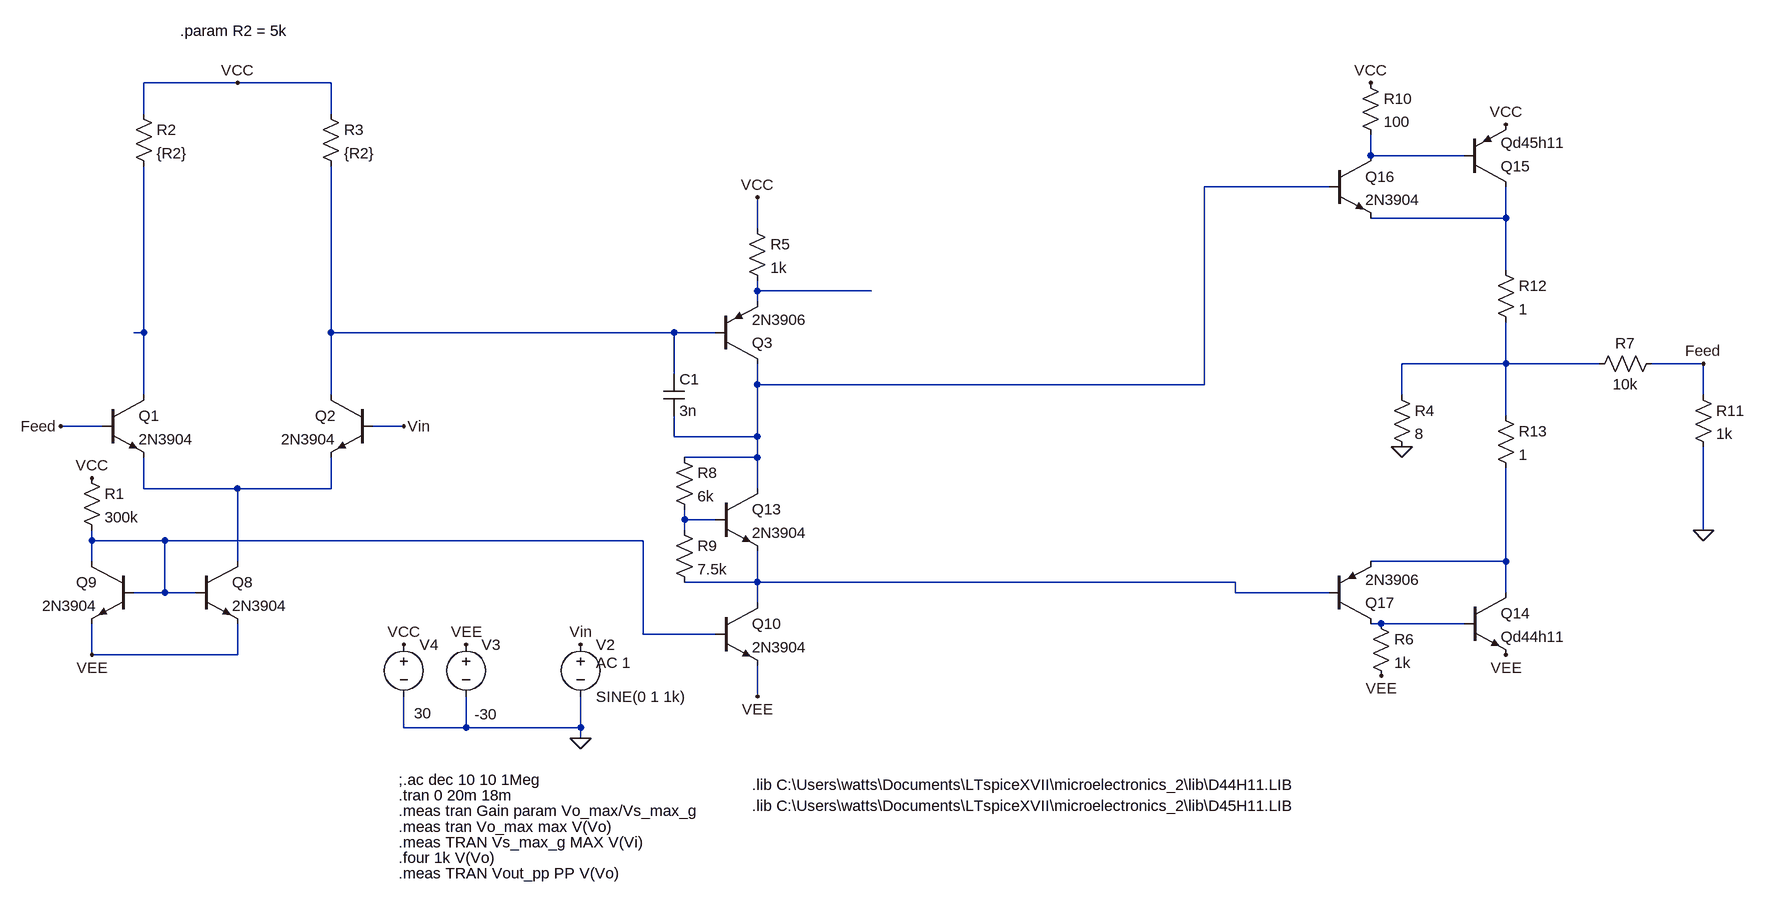
[diagram p0: schematic power_stage.asc]
power_stage.asc, the LTspice schematic file:
Version 4
SHEET 1 2772 704
WIRE 448 -976 304 -976
WIRE 592 -976 448 -976
WIRE 304 -928 304 -976
WIRE 592 -928 592 -976
WIRE 2192 -864 2192 -896
WIRE 2336 -864 2192 -864
WIRE 2128 -816 1936 -816
WIRE 2400 -768 2400 -816
WIRE 2400 -768 2192 -768
WIRE 1248 -752 1248 -800
WIRE 2400 -688 2400 -768
WIRE 1248 -656 1248 -672
WIRE 1424 -656 1248 -656
WIRE 1248 -640 1248 -656
WIRE 304 -592 304 -848
WIRE 304 -592 288 -592
WIRE 592 -592 592 -848
WIRE 1120 -592 592 -592
WIRE 1184 -592 1120 -592
WIRE 2400 -544 2400 -608
WIRE 2400 -544 2240 -544
WIRE 2544 -544 2400 -544
WIRE 2704 -544 2624 -544
WIRE 1120 -528 1120 -592
WIRE 1248 -512 1248 -544
WIRE 1936 -512 1936 -816
WIRE 1936 -512 1248 -512
WIRE 304 -496 304 -592
WIRE 592 -496 592 -592
WIRE 2240 -496 2240 -544
WIRE 2704 -496 2704 -544
WIRE 2400 -464 2400 -544
WIRE 240 -448 176 -448
WIRE 704 -448 656 -448
WIRE 1120 -432 1120 -464
WIRE 1248 -432 1248 -512
WIRE 1248 -432 1120 -432
WIRE 1248 -400 1248 -432
WIRE 1248 -400 1136 -400
WIRE 304 -352 304 -400
WIRE 448 -352 304 -352
WIRE 592 -352 592 -400
WIRE 592 -352 448 -352
WIRE 1248 -352 1248 -400
WIRE 1136 -304 1136 -320
WIRE 1184 -304 1136 -304
WIRE 1136 -288 1136 -304
WIRE 2704 -288 2704 -416
WIRE 224 -272 224 -288
WIRE 336 -272 224 -272
WIRE 1072 -272 336 -272
WIRE 224 -240 224 -272
WIRE 448 -240 448 -352
WIRE 2400 -240 2400 -384
WIRE 2400 -240 2192 -240
WIRE 1248 -208 1248 -256
WIRE 1248 -208 1136 -208
WIRE 1984 -208 1248 -208
WIRE 336 -192 336 -272
WIRE 336 -192 288 -192
WIRE 384 -192 336 -192
WIRE 1984 -192 1984 -208
WIRE 2128 -192 1984 -192
WIRE 2400 -192 2400 -240
WIRE 1248 -176 1248 -208
WIRE 2208 -144 2192 -144
WIRE 2336 -144 2208 -144
WIRE 1072 -128 1072 -272
WIRE 1184 -128 1072 -128
WIRE 224 -96 224 -144
WIRE 448 -96 448 -144
WIRE 448 -96 224 -96
WIRE 1248 -32 1248 -80
WIRE 704 16 704 -32
WIRE 800 16 800 -32
WIRE 800 16 704 16
WIRE 976 16 976 -32
WIRE 976 16 800 16
WIRE 976 32 976 16
FLAG 976 32 0
FLAG 976 -112 Vin
FLAG 800 -112 VEE
FLAG 704 -112 VCC
FLAG 704 -448 Vin
FLAG 448 -976 VCC
FLAG 224 -368 VCC
FLAG 1248 -800 VCC
FLAG 224 -96 VEE
FLAG 1248 -32 VEE
FLAG 176 -448 Feed
FLAG 2192 -976 VCC
FLAG 2400 -912 VCC
FLAG 2400 -96 VEE
FLAG 2208 -64 VEE
FLAG 2704 -288 0
FLAG 2704 -544 Feed
FLAG 2240 -416 0
DATAFLAG 448 -352 ""
DATAFLAG 1328 -512 ""
DATAFLAG 288 -592 ""
DATAFLAG 816 -272 ""
DATAFLAG 1360 -32 "Ic(Q10)"
DATAFLAG 2272 -864 ""
DATAFLAG 2304 -768 ""
DATAFLAG 2304 -240 ""
DATAFLAG 2256 -144 ""
DATAFLAG 1344 -208 ""
DATAFLAG 1136 -304 ""
DATAFLAG 1408 -656 ""
DATAFLAG 784 -592 ""
SYMBOL voltage 976 -128 R0
WINDOW 123 24 44 Left 2
WINDOW 39 0 0 Left 0
SYMATTR Value2 AC 1
SYMATTR InstName V2
SYMATTR Value SINE(0 1 1k)
SYMBOL voltage 800 -128 R0
WINDOW 3 13 123 Left 2
SYMATTR Value -30
SYMATTR InstName V3
SYMBOL voltage 704 -128 R0
WINDOW 3 16 122 Left 2
WINDOW 123 0 0 Left 0
WINDOW 39 0 0 Left 0
SYMATTR Value 30
SYMATTR InstName V4
SYMBOL npn 240 -496 R0
SYMATTR InstName Q1
SYMATTR Value 2N3904
SYMBOL npn 656 -496 M0
SYMATTR InstName Q2
SYMATTR Value 2N3904
SYMBOL res 288 -944 R0
SYMATTR InstName R2
SYMATTR Value {R2}
SYMBOL res 576 -944 R0
SYMATTR InstName R3
SYMATTR Value {R2}
SYMBOL res 1232 -768 R0
SYMATTR InstName R5
SYMATTR Value 1k
SYMBOL pnp 1184 -544 M180
SYMATTR InstName Q3
SYMATTR Value 2N3906
SYMBOL npn 384 -240 R0
SYMATTR InstName Q8
SYMATTR Value 2N3904
SYMBOL npn 288 -240 M0
SYMATTR InstName Q9
SYMATTR Value 2N3904
SYMBOL res 208 -384 R0
SYMATTR InstName R1
SYMATTR Value 300k
SYMBOL npn 1184 -176 R0
SYMATTR InstName Q10
SYMATTR Value 2N3904
SYMBOL npn 1184 -352 R0
SYMATTR InstName Q13
SYMATTR Value 2N3904
SYMBOL res 1120 -416 R0
SYMATTR InstName R8
SYMATTR Value 6k
SYMBOL res 1120 -304 R0
SYMATTR InstName R9
SYMATTR Value 7.5k
SYMBOL pnp 2336 -816 M180
SYMATTR InstName Q15
SYMATTR Value Qd45h11
SYMBOL npn 2336 -192 R0
SYMATTR InstName Q14
SYMATTR Value Qd44h11
SYMBOL npn 2128 -864 R0
SYMATTR InstName Q16
SYMATTR Value 2N3904
SYMBOL res 2176 -992 R0
SYMATTR InstName R10
SYMATTR Value 100
SYMBOL pnp 2128 -144 M180
SYMATTR InstName Q17
SYMATTR Value 2N3906
SYMBOL res 2192 -160 R0
SYMATTR InstName R6
SYMATTR Value 1k
SYMBOL res 2640 -560 R90
WINDOW 0 0 56 VBottom 2
WINDOW 3 32 56 VTop 2
SYMATTR InstName R7
SYMATTR Value 10k
SYMBOL res 2688 -512 R0
SYMATTR InstName R11
SYMATTR Value 1k
SYMBOL res 2384 -704 R0
SYMATTR InstName R12
SYMATTR Value 1
SYMBOL res 2384 -480 R0
SYMATTR InstName R13
SYMATTR Value 1
SYMBOL cap 1104 -528 R0
SYMATTR InstName C1
SYMATTR Value 3n
SYMBOL res 2224 -512 R0
SYMATTR InstName R4
SYMATTR Value 8
TEXT 696 192 Left 2 !.meas TRAN Vs_max_g MAX V(Vi)
TEXT 696 168 Left 2 !.meas tran Vo_max max V(Vo)
TEXT 696 144 Left 2 !.meas tran Gain param Vo_max/Vs_max_g
TEXT 696 96 Left 2 !;.ac dec 10 10 1Meg
TEXT 696 120 Left 2 !.tran 0 20m 18m
TEXT 696 216 Left 2 !.four 1k V(Vo)
TEXT 360 -1056 Left 2 !.param R2 = 5k
TEXT 696 240 Left 2 !.meas TRAN Vout_pp PP V(Vo)
TEXT 1240 104 Left 2 !.lib C:\\Users\\watts\\Documents\\LTspiceXVII\\microelectronics_2\\lib\\D44H11.LIB
TEXT 1240 136 Left 2 !.lib C:\\Users\\watts\\Documents\\LTspiceXVII\\microelectronics_2\\lib\\D45H11.LIB

The netlist it stands for:
* power_stage.asc
V2 Vin 0 SINE(0 1 1k) AC 1
V3 VEE 0 -30
V4 VCC 0 30
Q1 N005 Feed N008 0 2N3904
Q2 N006 Vin N008 0 2N3904
R2 VCC N005 {R2}
R3 VCC N006 {R2}
R5 VCC N004 1k
Q3 N002 N006 N004 0 2N3906
Q8 N008 N010 VEE 0 2N3904
Q9 N010 N010 VEE 0 2N3904
R1 VCC N010 300k
Q10 N012 N010 VEE 0 2N3904
Q13 N002 N009 N012 0 2N3904
R8 N002 N009 6k
R9 N009 N012 7.5k
Q15 N003 N001 VCC 0 Qd45h11
Q14 N011 N013 VEE 0 Qd44h11
Q16 N001 N002 N003 0 2N3904
R10 VCC N001 100
Q17 N013 N012 N011 0 2N3906
R6 N013 VEE 1k
R7 Feed N007 10k
R11 Feed 0 1k
R12 N003 N007 1
R13 N007 N011 1
C1 N006 N002 3n
R4 N007 0 8
.model NPN NPN
.model PNP PNP
.lib standard.bjt
.meas TRAN Vs_max_g MAX V(Vi)
.meas tran Vo_max max V(Vo)
.meas tran Gain param Vo_max/Vs_max_g
;.ac dec 10 10 1Meg
.tran 0 20m 18m
.four 1k V(Vo)
.param R2 = 5k
.meas TRAN Vout_pp PP V(Vo)
.lib C:\Users\watts\Documents\LTspiceXVII\microelectronics_2\lib\D44H11.LIB
.lib C:\Users\watts\Documents\LTspiceXVII\microelectronics_2\lib\D45H11.LIB
.backanno
.end